# Altium schematic sheet ORD_FV1_1.SchDoc
size 420 x 297 mm; Address1: Address1; Address2: Address2; Address3: Address3; Address4: Address4; DocumentNumber: АБВГ.123456.001 Э3; SheetNumber: 1; Scale: 1:1; DocumentType: Схема электрическая принципиальная; FirstReferrence: АБВГ.123456.001
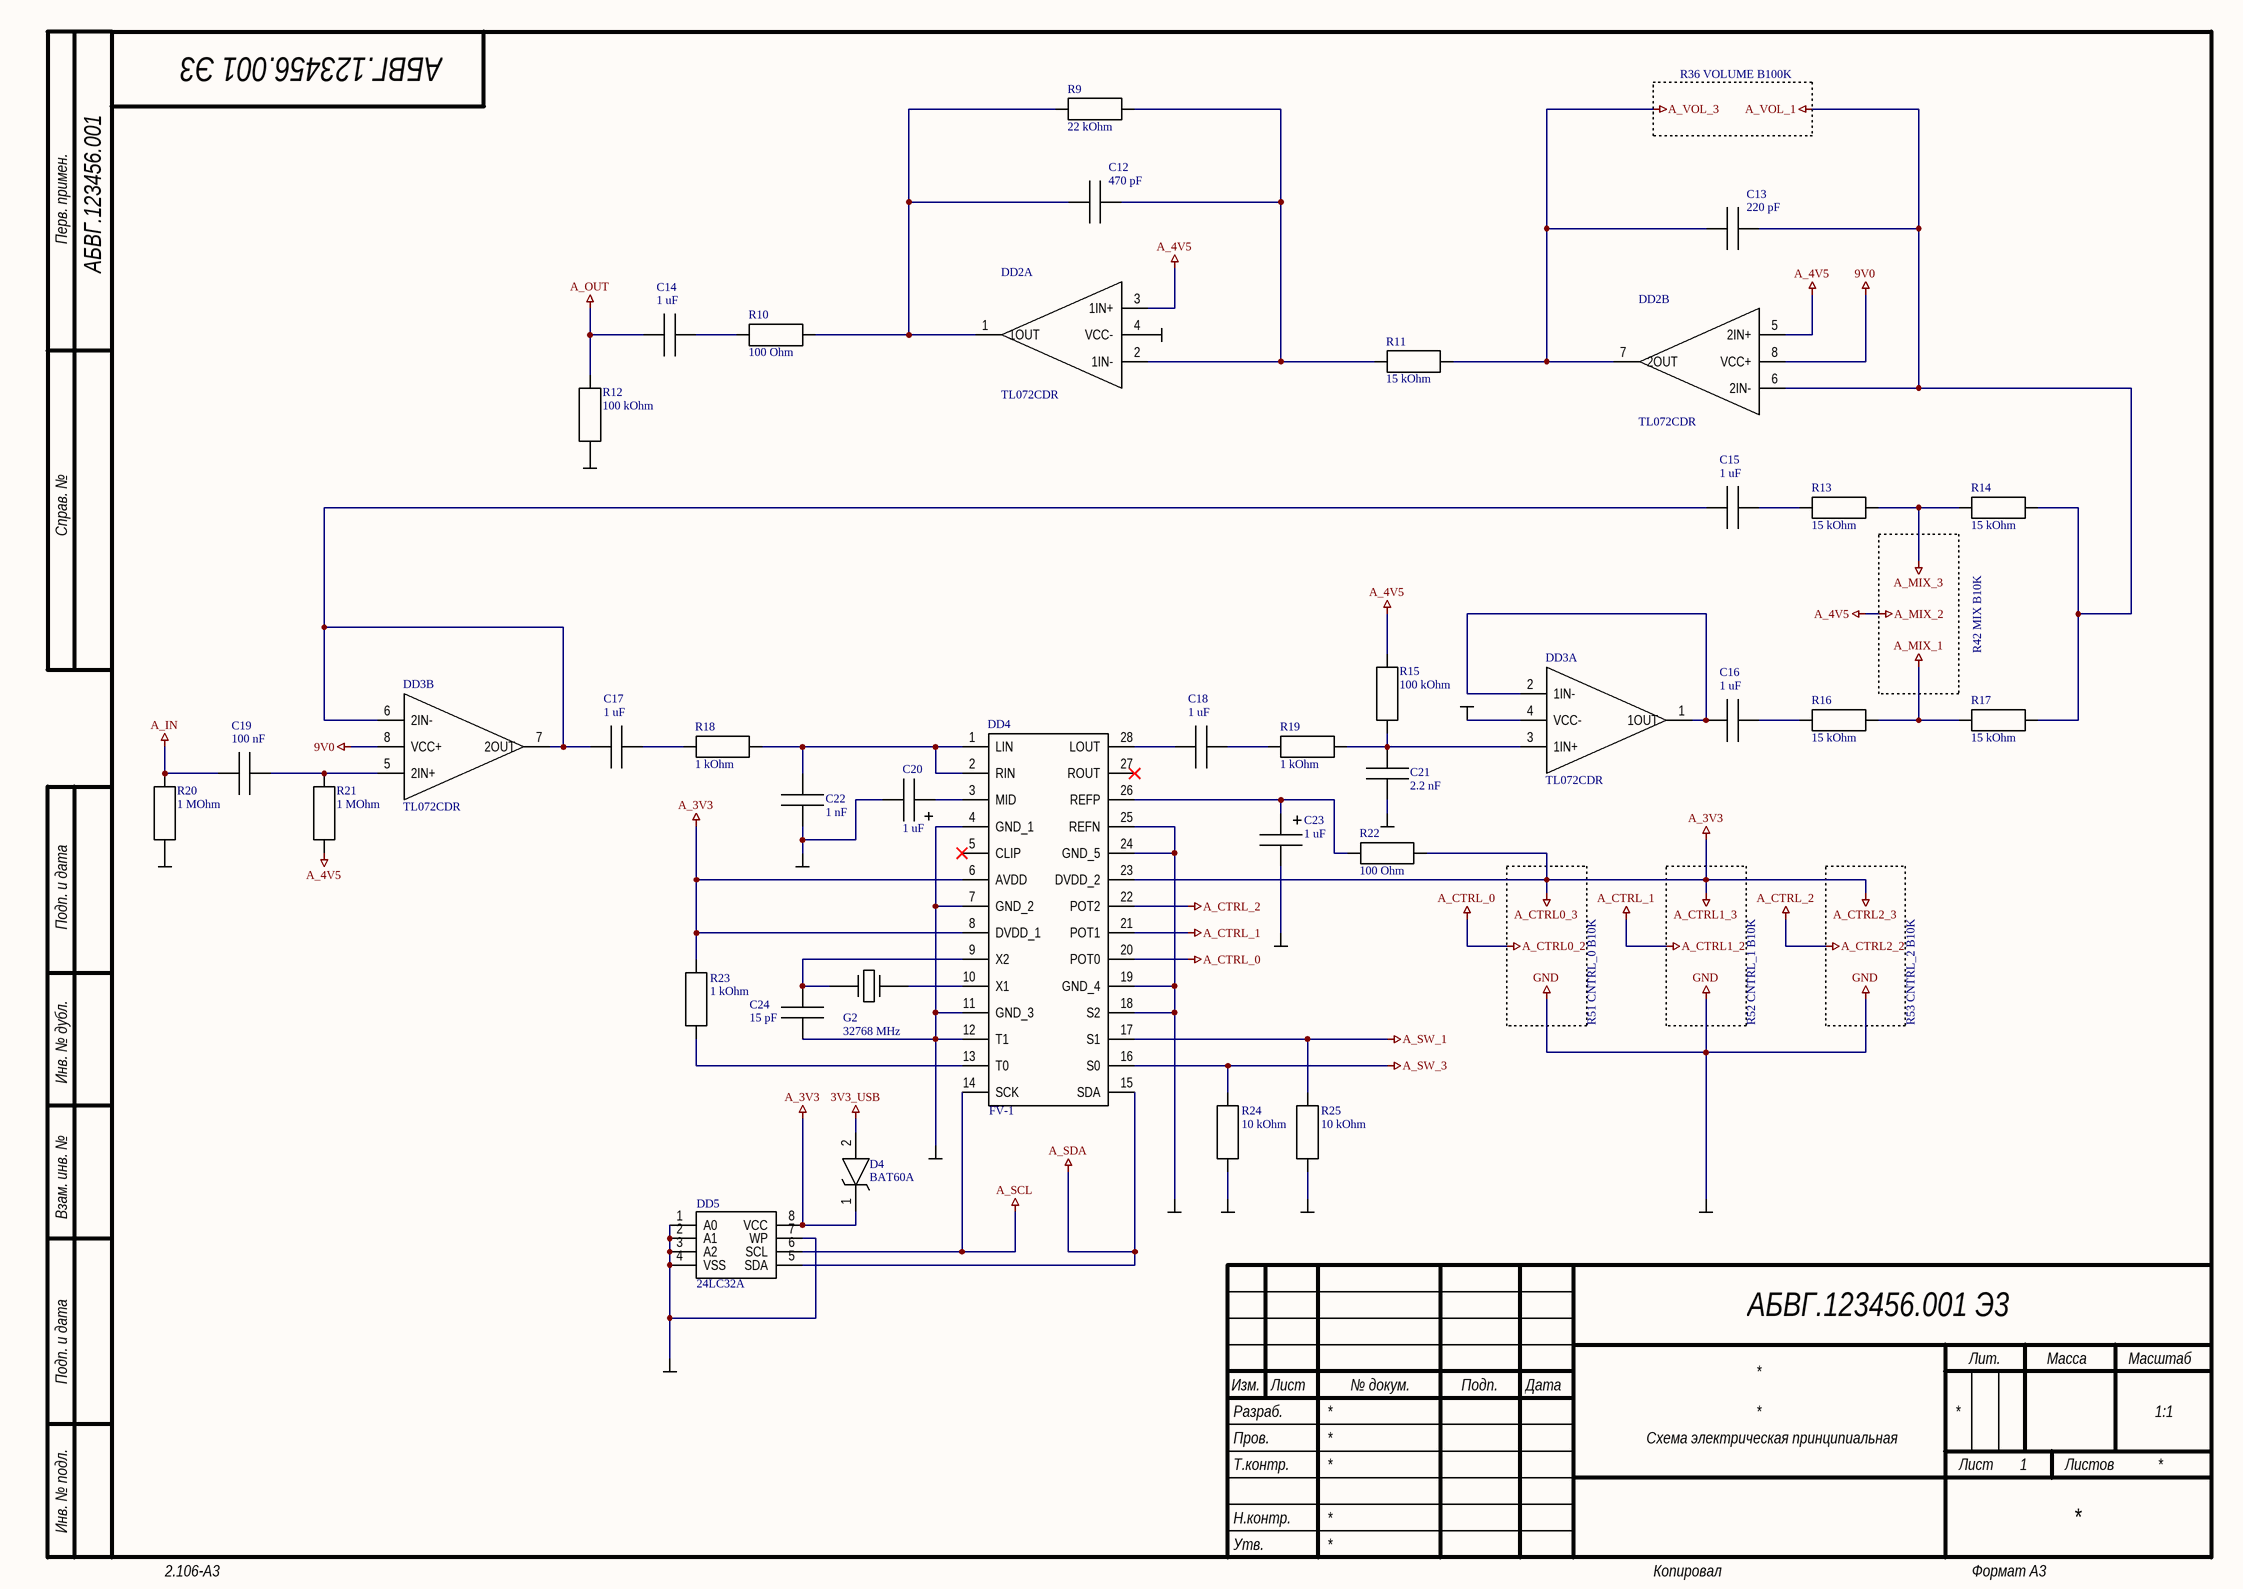
[diagram p0: ORD_FV1_1.SchDoc]

## Parts
C12  470 pF  [C0805[2012]]
C13  220 pF  [C0805[2012]]
C14  1 uF  [C0805[2012]]
C15  1 uF  [C0805[2012]]
C16  1 uF  [C0805[2012]]
C17  1 uF  [C0805[2012]]
C18  1 uF  [C0805[2012]]
C19  100 nF  [C0805[2012]]
C20  1 uF  [C3216_CASE-A]
C21  2.2 nF  [C0805[2012]]
C22  1 nF  [C0805[2012]]
C23  1 uF  [C3216_CASE-A]
C24  15 pF  [C0805[2012]]
D4  BAT60A  [SOD323]
DD2  TL072CDR  [SO8]  (parts A,B of 2)
DD3  TL072CDR  [SO8]  (parts A,B of 2)
DD4  FV-1  [SOIC28]
DD5  24LC32A  [DIP8_WITH_SOCKET]
G2  32768 MHz  [HC-49]
R9  22 kOhm  [R0805[2012]]
R10  100 Ohm  [R0805[2012]]
R11  15 kOhm  [R0805[2012]]
R12  100 kOhm  [R0805[2012]]
R13  15 kOhm  [R0805[2012]]
R14  15 kOhm  [R0805[2012]]
R15  100 kOhm  [R0805[2012]]
R16  15 kOhm  [R0805[2012]]
R17  15 kOhm  [R0805[2012]]
R18  1 kOhm  [R0805[2012]]
R19  1 kOhm  [R0805[2012]]
R20  1 MOhm  [R0805[2012]]
R21  1 MOhm  [R0805[2012]]
R22  100 Ohm  [R0805[2012]]
R23  1 kOhm  [R0805[2012]]
R24  10 kOhm  [R0805[2012]]
R25  10 kOhm  [R0805[2012]]

## Nets
3V3_USB: D4.2(A)
9V0: DD2.8(VCC+) DD3.8(VCC+)
A_3V3: D4.1(K) DD4.6(AVDD) DD4.8(DVDD_1) DD4.23(DVDD_2) DD5.8(VCC) R22.1 R23.2  [also labelled A_CTRL0_3, A_CTRL1_3, A_CTRL2_3]
A_4V5: DD2.3(1IN+) DD2.5(2IN+) R15.1 R21.1  [also labelled A_MIX_2]
A_CTRL0_2: DD4.20(POT0)  [also labelled A_CTRL_0]
A_CTRL1_2: DD4.21(POT1)  [also labelled A_CTRL_1]
A_CTRL2_2: DD4.22(POT2)  [also labelled A_CTRL_2]
A_IN: C19.1 R20.2
A_MIX_1: R16.1 R17.2
A_MIX_3: R13.1 R14.2
A_OUT: C14.1 R12.2
A_SCL: DD4.14(SCK) DD5.6(SCL)
A_SDA: DD4.15(SDA) DD5.5(SDA)
A_SW_1: DD4.17(S1) R25.2
A_SW_3: DD4.16(S0) R24.2
A_VOL_1: C13.2 DD2.6(2IN-) R14.1 R17.1
A_VOL_3: C13.1 DD2.7(2OUT) R11.1
GND: C20.2 C21.1 C22.1 C23.2 C24.2 DD2.4(VCC-) DD3.4(VCC-) DD4.4(GND_1) DD4.7(GND_2) DD4.11(GND_3) DD4.12(T1) DD4.18(S2) DD4.19(GND_4) DD4.24(GND_5) DD4.25(REFN) DD5.1(A0) DD5.2(A1) DD5.3(A2) DD5.4(VSS) DD5.7(WP) R12.1 R20.1 R24.1 R25.1
NetC12_1: C12.1 DD2.1(1OUT) R9.2 R10.1
NetC12_2: C12.2 DD2.2(1IN-) R9.1 R11.2
NetC14_2: C14.2 R10.2
NetC15_1: C15.1 C17.1 DD3.6(2IN-) DD3.7(2OUT)
NetC15_2: C15.2 R13.2
NetC16_1: C16.1 DD3.1(1OUT) DD3.2(1IN-)
NetC16_2: C16.2 R16.2
NetC17_2: C17.2 R18.2
NetC18_1: C18.1 DD4.28(LOUT)
NetC18_2: C18.2 R19.2
NetC19_2: C19.2 DD3.5(2IN+) R21.2
NetC20_1: C20.1 DD4.3(MID)
NetC21_2: C21.2 DD3.3(1IN+) R15.2 R19.1
NetC22_2: C22.2 DD4.1(LIN) DD4.2(RIN) R18.1
NetC23_1: C23.1 DD4.26(REFP) R22.2
NetC24_1: C24.1 DD4.9(X2) G2.1
NetDD4_10: DD4.10(X1) G2.2
NetDD4_13: DD4.13(T0) R23.1

Not connected (* = marked no-connect by the designer): DD4 5(CLIP)* 27(ROUT)*

## Notes on the sheet
- R36 VOLUME B100K
- R42 MIX B10K
- R51 CNTRL_0 B10K
- R52 CNTRL_1 B10K
- R53 CNTRL_2 B10K
- Перв. примен.
- Справ. №
- Подп. и дата
- Инв. № дубл.
- Взам. инв. №
- Разраб.
- Изм.
- Лист
- № докум.
- Подп.
- Дата
- Лит.
- Масса
- Масштаб
- Пров.
- Т.контр.
- Листов
- Инв. № подл.
- Утв.
- Н.контр.
- 2.106-A3
- Копировал
- Формат А3

## Library data of the parts
C12-C19 C21 C22 C24 = Capacitor: Manufacture: *; ManufacturerPartNumber: *; Power/Voltage: *; Quantity: *; Rem: *; TKE: *; Tolerance: *; Корпус: *; Примечание: *
  C12: Value: 470 pF
  C13: Value: 220 pF
  C14-C18: Value: 1 uF
  C19: Value: 100 nF
  C21: Value: 2.2 nF
  C22: Value: 1 nF
  C24: Value: 15 pF
C20 C23 = Capacitor_Pol: Manufacture: *; ManufacturerPartNumber: *; Power/Voltage: *; Quantity: *; Rem: *; TKE: *; Tolerance: *; Value: 1 uF; Корпус: *; Примечание: *
D4 = BAT60A: Diode Schottky 10V 3A Automotive 2-Pin SOD-323 T/R; Manufacturer_Part_Number: BAT60A; Arrow Part Number: BAT60A
DD2 DD3 = TL072CDR: TL072CDR, Dual Operational Amplifier 4 MHz -18 to 18V, 8-Pin SO; Manufacturer_Name: STMicroelectronics; Manufacturer_Part_Number: LM358DT; Allied_Number: 70013708; Geometry.Height: 1.75mm; Mouser Part Number: 511-LM358DT; Mouser Price/Stock: https://www.mouser.com/Search/Refine.aspx?Keyword=511-LM358DT; RS Part Number: 7140827P; RS Price/Stock: http://uk.rs-online.com/web/p/products/7140827P; Allied Price/Stock: http://www.alliedelec.com/stmicroelectronics-lm358dt/70013708/; Datasheet Link: http://www.st.com/st-web-ui/static/active/en/resource/technical/document/datasheet/CD00000464.pdf
DD4 = FV-1: FV-1 Reverb IC, Integrated Stereo ADC & DAC, Integrated Circuit, SOIC-28 300 MIL; Manufacturer_Name: Spin Semiconductor; Geometry.Height: 2.51mm; Manufacturer_Part_Number: FV-1 Reverb IC; Mouser Part Number: *; Mouser Price/Stock: *; RS Part Number: *; RS Price/Stock: *; Datasheet Link: http://www.spinsemi.com/Products/datasheets/spn1001/FV-1.pdf
DD5 = 24LC32A: 32K I2C Serial EEPROM with Quarter-Array Write-Protect; Manufacturer_Name: Microchip; Manufacturer_Part_Number: 24LC32AF-I/P; Allied_Number: 70570177; Mouser Part Number: 579-24LC32AF-I/P; Mouser Price/Stock: https://www.mouser.com/Search/Refine.aspx?Keyword=579-24LC32AF-I%2FP; RS Part Number: *; RS Price/Stock: *; Allied Price/Stock: https://www.alliedelec.com/microchip-technology-inc-24lc32af-i-p/70570177/; Datasheet Link: *
G2 = Crystal_2pin: Value: *
R9-R25 = Resistor: Manufacture: *; ManufacturerPartNumber: *; Power/Voltage: *; Quantity: *; Rem: *; TKE: *; Tolerance: *; Корпус: *; Примечание: *
  R9: Value: 22 kOhm
  R10 R22: Value: 100 Ohm
  R11 R13 R14 R16 R17: Value: 15 kOhm
  R12 R15: Value: 100 kOhm
  R18 R19 R23: Value: 1 kOhm
  R20 R21: Value: 1 MOhm
  R24 R25: Value: 10 kOhm